# EasyEDA schematic echo.json
TITLE: echo device wiring; REV: 22.03.05; Date: 2022-03-05; Sheet: 1/1; Company: RVMS-Capstone
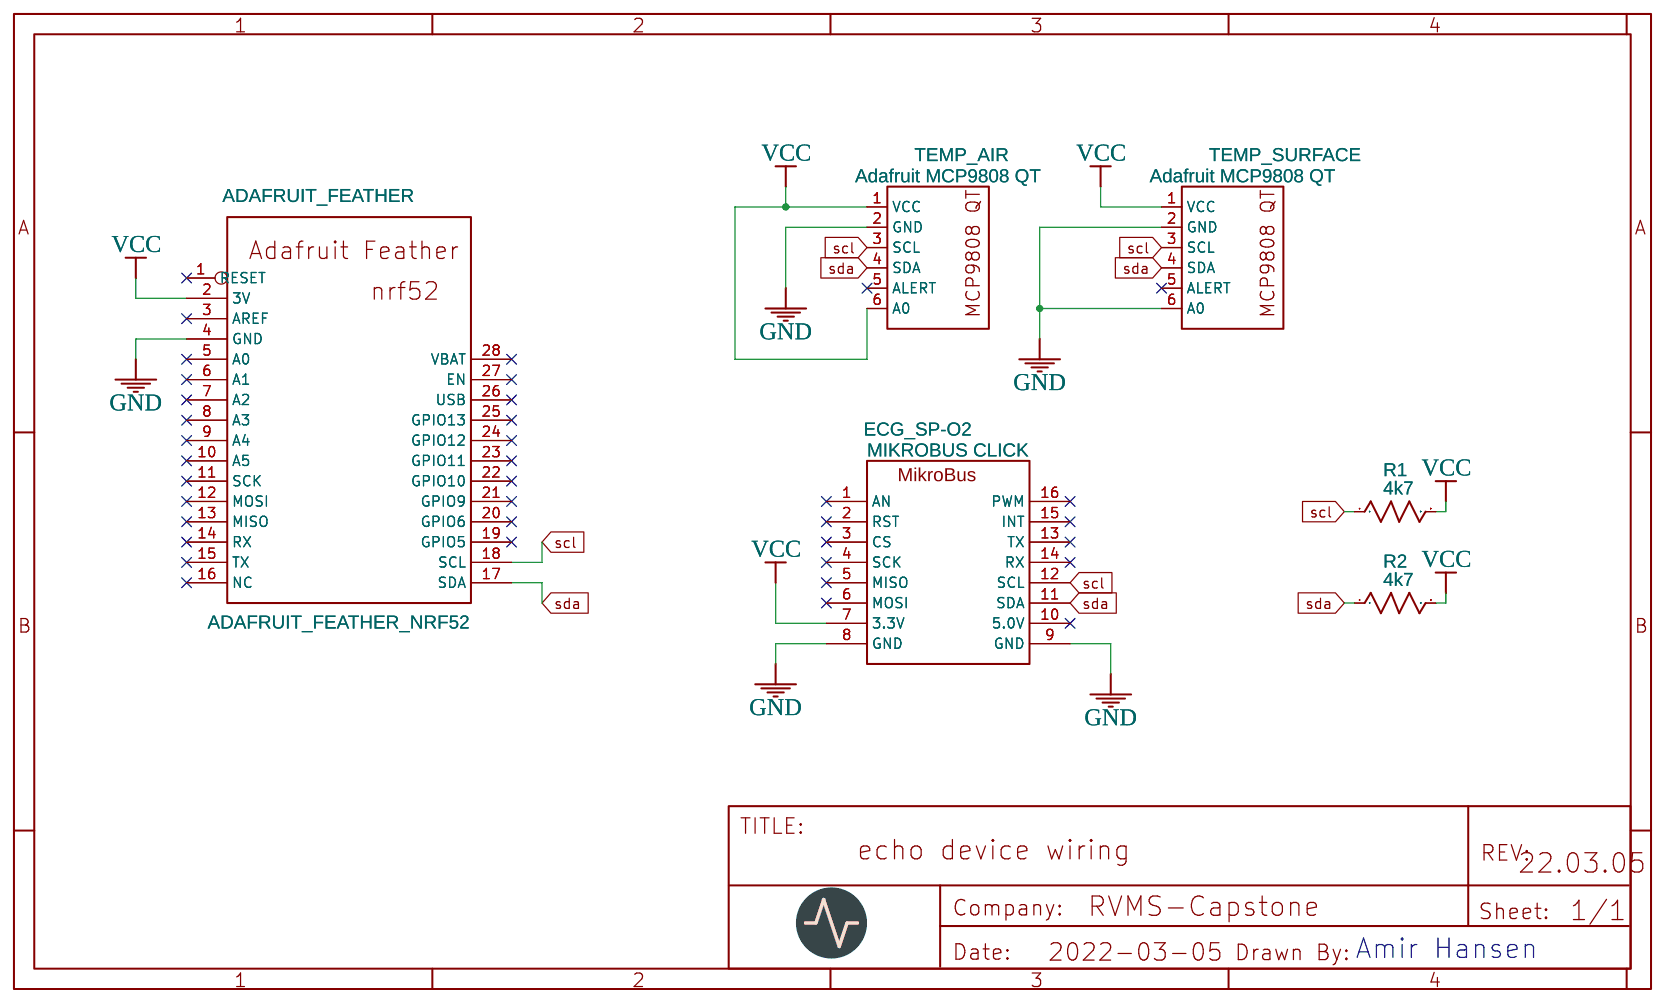
[diagram p0: schematic sheet]

## Parts
ADAFRUIT_FEATHER  ADAFRUIT_FEATHER_NRF52  [ADAFRUIT_FEATHER_NRF52]
ECG_SP-O2  MIKROBUS CLICK  [MIKROBUS_CLICK]
R1  4k7  [R_AXIAL-0.3]
R2  4k7  [R_AXIAL-0.3]
TEMP_AIR  Adafruit MCP9808 QT  [ADAFRUIT MCP9808 QT]
TEMP_SURFACE  Adafruit MCP9808 QT  [ADAFRUIT MCP9808 QT]

## Library data of the parts
ADAFRUIT_FEATHER = Adafruit Feather nrf52: Contributor: adrianarnett0
ECG_SP-O2 = MIKROBUS CLICK: Mikrobus Click Board; Contributor: Mia2b
R1 R2 = R_AXIAL-0.3_US: Contributor: LCEDA_Lib
TEMP_AIR TEMP_SURFACE = Adafruit MCP9808 QT: Supplier: Adafruit; Contributor: Mia2b

## Nets
GND: ADAFRUIT_FEATHER.4(GND) ECG_SP-O2.8(GND) ECG_SP-O2.9(GND) TEMP_AIR.2(GND) TEMP_SURFACE.2(GND) TEMP_SURFACE.6(A0)
VCC: ADAFRUIT_FEATHER.2(3V) ECG_SP-O2.7(3.3V) R1.2 R2.2 TEMP_AIR.1(VCC) TEMP_AIR.6(A0) TEMP_SURFACE.1(VCC)
scl: ADAFRUIT_FEATHER.18(SCL) ECG_SP-O2.12(SCL) R1.1 TEMP_AIR.3(SCL) TEMP_SURFACE.3(SCL)
sda: ADAFRUIT_FEATHER.17(SDA) ECG_SP-O2.11(SDA) R2.1 TEMP_AIR.4(SDA) TEMP_SURFACE.4(SDA)

Not connected (* = marked no-connect by the designer): ADAFRUIT_FEATHER 1(RESET)* 3(AREF)* 5(A0)* 6(A1)* 7(A2)* 8(A3)* 9(A4)* 10(A5)* 11(SCK)* 12(MOSI)* 13(MISO)* 14(RX)* 15(TX)* 16(NC)* 19(GPIO5)* 20(GPIO6)* 21(GPIO9)* 22(GPIO10)* 23(GPIO11)* 24(GPIO12)* 25(GPIO13)* 26(USB)* 27(EN)* 28(VBAT)*; ECG_SP-O2 1(AN)* 2(RST)* 3(CS)* 4(SCK)* 5(MISO)* 6(MOSI)* 10(5.0V)* 13(TX)* 14(RX)* 15(INT)* 16(PWM)*; TEMP_AIR 5(ALERT)*; TEMP_SURFACE 5(ALERT)*

## Notes on the sheet
- Amir Hansen
